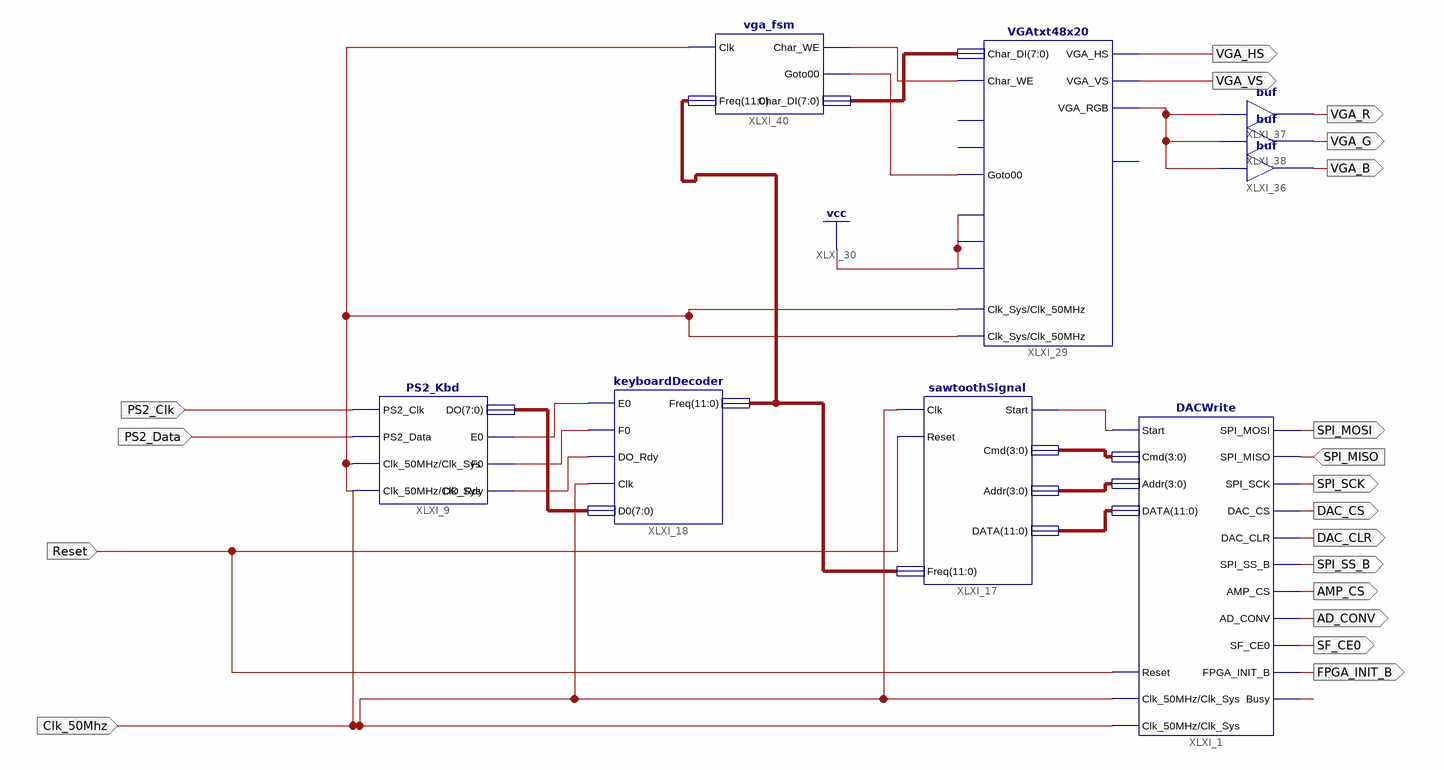
[diagram p0: schematic sheet 1]
// Xilinx ISE schematic schemat.sch (spartan3e) as structural Verilog: 9 symbols, 19 ports
module schemat (
  input  Reset,
  input  SPI_MISO,
  input  PS2_Clk,
  input  PS2_Data,
  input  Clk_50Mhz,
  output SPI_MOSI,
  output SPI_SCK,
  output DAC_CS,
  output DAC_CLR,
  output SPI_SS_B,
  output AMP_CS,
  output AD_CONV,
  output SF_CE0,
  output FPGA_INIT_B,
  output VGA_HS,
  output VGA_VS,
  output VGA_R,
  output VGA_G,
  output VGA_B
);

  wire XLXN_21, XLXN_57, XLXN_133, XLXN_134, XLXN_135, XLXN_208, XLXN_209, XLXN_230;
  wire [3:0] XLXN_2, XLXN_3;
  wire [7:0] XLXN_132, XLXN_237;
  wire [11:0] XLXN_4, XLXN_138;

  DACWrite XLXI_1 (
    .Reset(Reset), .Start(XLXN_57), .SPI_MISO(SPI_MISO), .Cmd(XLXN_2), .Addr(XLXN_3), .DATA(XLXN_4),
    .DAC_CLR(DAC_CLR), .DAC_CS(DAC_CS), .SPI_MOSI(SPI_MOSI), .SPI_SCK(SPI_SCK), .SPI_SS_B(SPI_SS_B),
    .AMP_CS(AMP_CS), .AD_CONV(AD_CONV), .SF_CE0(SF_CE0), .FPGA_INIT_B(FPGA_INIT_B), .Busy(XLXN_21),
    .Clk_50MHz(Clk_50Mhz), .Clk_Sys(Clk_50Mhz));
  PS2_Kbd XLXI_9 (
    .PS2_Clk(PS2_Clk), .PS2_Data(PS2_Data), .Clk_50MHz(Clk_50Mhz), .E0(XLXN_133), .F0(XLXN_134),
    .DO_Rdy(XLXN_135), .DO(XLXN_132), .Clk_Sys(Clk_50Mhz));
  sawtoothSignal XLXI_17 (
    .Clk(Clk_50Mhz), .Reset(Reset), .Freq(XLXN_138), .Start(XLXN_57), .Cmd(XLXN_2), .Addr(XLXN_3),
    .DATA(XLXN_4));
  keyboardDecoder XLXI_18 (
    .E0(XLXN_133), .F0(XLXN_134), .DO_Rdy(XLXN_135), .Clk(Clk_50Mhz), .D0(XLXN_132), .Freq(XLXN_138));
  VGAtxt48x20 XLXI_29 (
    .Char_DI(XLXN_237), .Goto00(XLXN_208), .Clk_Sys(Clk_50Mhz), .Clk_50MHz(Clk_50Mhz), .CursorOn(1'b1),
    .ScrollEn(1'b1), .ScrollClear(1'b1), .VGA_HS(VGA_HS), .VGA_VS(VGA_VS), .VGA_RGB(XLXN_230),
    .Char_WE(XLXN_209));  // open: Home, NewLine, Busy
  buf XLXI_36 (VGA_B, XLXN_230);
  buf XLXI_37 (VGA_R, XLXN_230);
  buf XLXI_38 (VGA_G, XLXN_230);
  vga_fsm XLXI_40 (.Clk(Clk_50Mhz), .Freq(XLXN_138), .Char_WE(XLXN_209), .Goto00(XLXN_208), .Char_DI(XLXN_237));
endmodule
